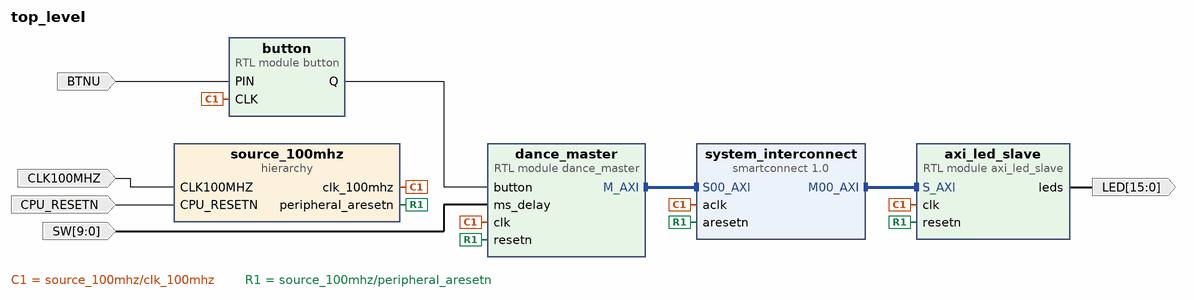
[diagram p0: block diagram of the top level]
# Vivado block design top_level, xc7a100tcsg324-1, Vivado 2021.1
create_bd_design top_level

create_bd_port -dir I -type clk CLK100MHZ
create_bd_port -dir I -type rst CPU_RESETN
create_bd_port -dir O -from 15 -to 0 LED
create_bd_port -dir I BTNU
create_bd_port -dir I -from 9 -to 0 SW

create_bd_cell -type hier source_100mhz
create_bd_cell -type ip -vlnv xilinx.com:ip:smartconnect:1.0 system_interconnect
set_property -dict {CONFIG.NUM_SI 1} [get_bd_cells system_interconnect]
create_bd_cell -type module -reference button button
create_bd_cell -type module -reference axi_led_slave axi_led_slave
create_bd_cell -type module -reference dance_master dance_master

# ---- hierarchy /source_100mhz ----
current_bd_instance /source_100mhz
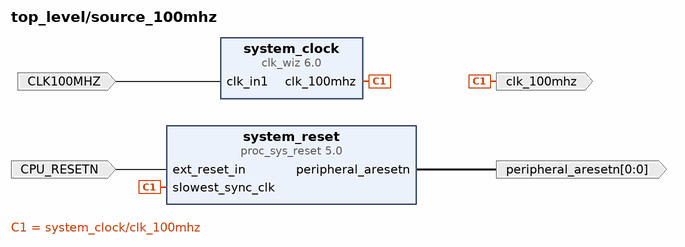
[diagram p1: block diagram inside /source_100mhz]
create_bd_pin -dir I -type clk CLK100MHZ
create_bd_pin -dir I -type rst CPU_RESETN
create_bd_pin -dir O -from 0 -to 0 peripheral_aresetn
create_bd_pin -dir O clk_100mhz

create_bd_cell -type ip -vlnv xilinx.com:ip:clk_wiz:6.0 system_clock
set_property -dict {CONFIG.CLK_OUT1_PORT clk_100mhz CONFIG.USE_LOCKED false CONFIG.USE_RESET false} [get_bd_cells system_clock]
create_bd_cell -type ip -vlnv xilinx.com:ip:proc_sys_reset:5.0 system_reset

# ---- connections ----

current_bd_instance /source_100mhz
connect_bd_net -net clk_in1_0_1 [get_bd_pins CLK100MHZ] [get_bd_pins system_clock/clk_in1]
connect_bd_net -net ext_reset_in_0_1 [get_bd_pins CPU_RESETN] [get_bd_pins system_reset/ext_reset_in]
connect_bd_net -net proc_sys_reset_0_peripheral_aresetn [get_bd_pins system_reset/peripheral_aresetn] [get_bd_pins peripheral_aresetn]
connect_bd_net [get_bd_pins system_clock/clk_100mhz] [get_bd_pins system_reset/slowest_sync_clk] [get_bd_pins clk_100mhz]

current_bd_instance /
connect_bd_intf_net [get_bd_intf_pins dance_master/M_AXI] [get_bd_intf_pins system_interconnect/S00_AXI]
connect_bd_intf_net [get_bd_intf_pins axi_led_slave/S_AXI] [get_bd_intf_pins system_interconnect/M00_AXI]
connect_bd_net -net PIN_0_1 [get_bd_ports BTNU] [get_bd_pins button/PIN]
connect_bd_net [get_bd_pins axi_led_slave/leds] [get_bd_ports LED]
connect_bd_net [get_bd_pins button/Q] [get_bd_pins dance_master/button]
connect_bd_net -net clk_in1_0_1 [get_bd_ports CLK100MHZ] [get_bd_pins source_100mhz/CLK100MHZ]
connect_bd_net -net delay_switches_0_1 [get_bd_ports SW] [get_bd_pins dance_master/ms_delay]
connect_bd_net -net ext_reset_in_0_1 [get_bd_ports CPU_RESETN] [get_bd_pins source_100mhz/CPU_RESETN]
connect_bd_net [get_bd_pins source_100mhz/clk_100mhz] \
  [get_bd_pins system_interconnect/aclk] [get_bd_pins button/CLK] [get_bd_pins axi_led_slave/clk] \
  [get_bd_pins dance_master/clk]
connect_bd_net [get_bd_pins source_100mhz/peripheral_aresetn] \
  [get_bd_pins system_interconnect/aresetn] [get_bd_pins axi_led_slave/resetn] [get_bd_pins dance_master/resetn]

# ---- address map ----
assign_bd_address -offset 0x00001000 -range 256 -target_address_space [get_bd_addr_spaces dance_master/M_AXI] [get_bd_addr_segs axi_led_slave/S_AXI/reg0]

validate_bd_design
save_bd_design
